# EAGLE design barometer (EAGLE 9.6.2)
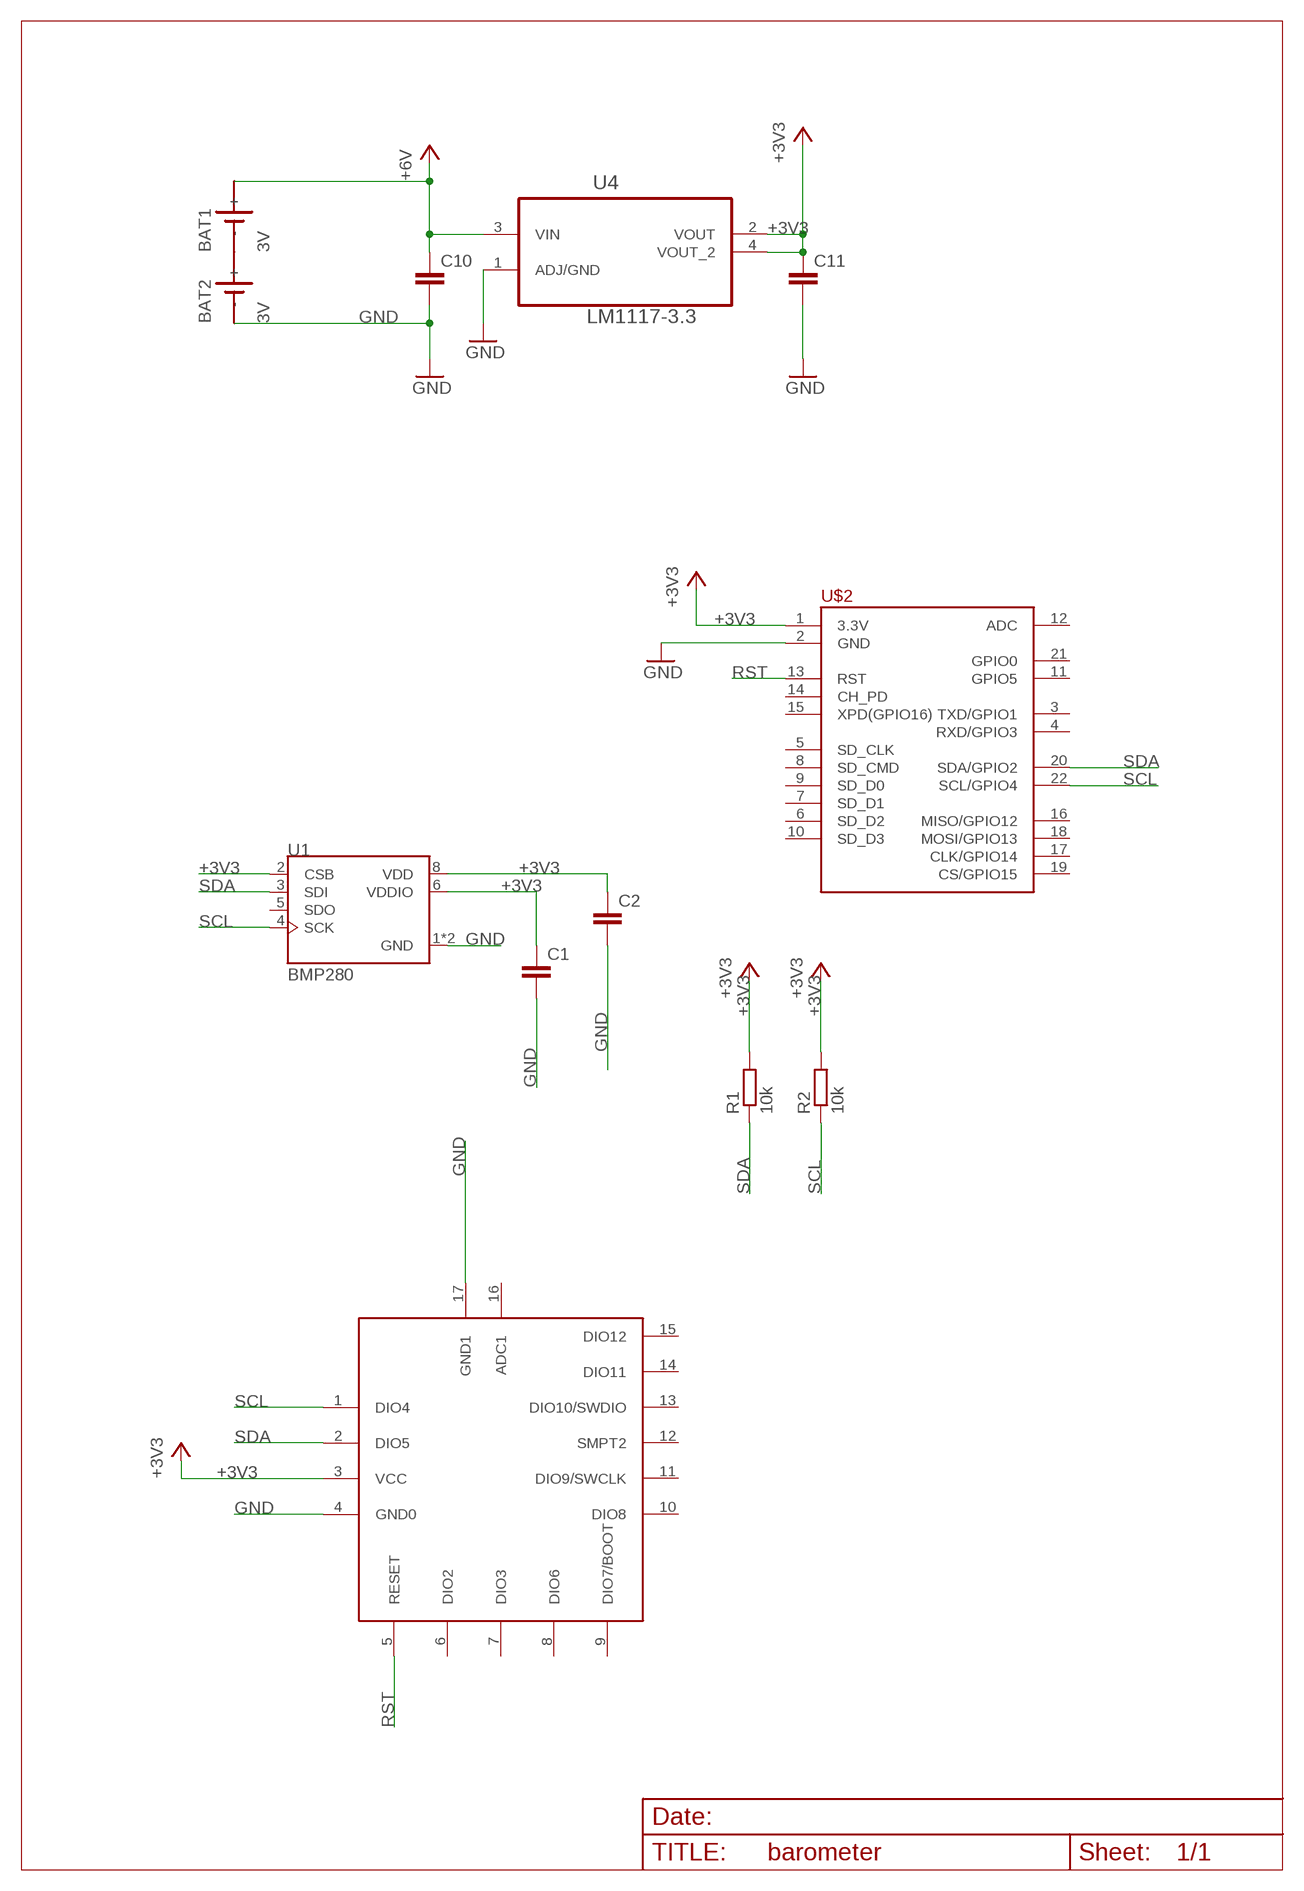
[diagram p0: schematic, sheet 1]

## Parts
BAT1  3V  SN2032  [SN2032]
BAT2  3V  SN2032  [SN2032]
C1  47u  C-EUC1206  [C1206]
C2  47u  C-EUC1206  [C1206]
C10  47u  C-EUC1206  [C1206]
C11  10u  C-EUC1206  [C1206]
R1  10k  R-EU_R0402  [R0402]
R2  10k  R-EU_R0402  [R0402]
U1  BMP280  [XDCR_BMP280]
U4  LM1117-3.3  [SOT230]
U$1  BLUENRG-234BLEMODULE  [BLUENRG-234BLEMODULE]
U$2  OLIMEX_MOD-WIFI-ESP8266-DEV>PINS-OUTSIDE  [OLIMEX_MOD-WIFI-ESP8266-DEV-PINS-OUTSIDE]

## Nets
+3V3 [supply]: C1.1 C2.1 C11.1 R1.2 R2.2 U1.2(CSB) U1.6(VDDIO) U1.8(VDD) U4.2(VOUT) U4.4(VOUT_2) U$1.3(VCC) U$2.1(3.3V)
+6V [supply]: BAT1.+ C10.1 U4.3(VIN)
GND: BAT2.- C1.2 C2.2 C10.2 C11.2 U1.1(GND) U1.7(GND) U4.1(ADJ/GND) U$1.4(GND0) U$1.17(GND1) U$2.2(GND)
N$1: BAT1.- BAT2.+
RST: U$1.5(RESET) U$2.13(RST)
SCL: R2.1 U1.4(SCK) U$1.1(DIO4) U$2.22(SCL/GPIO4)
SDA: R1.1 U1.3(SDI) U$1.2(DIO5) U$2.20(SDA/GPIO2)
Unconnected: U1.5(SDO) U$1.6(DIO2) U$1.7(DIO3) U$1.8(DIO6) U$1.9(DIO7/BOOT) U$1.10(DIO8) U$1.11(DIO9/SWCLK) U$1.12(SMPT2) U$1.13(DIO10/SWDIO) U$1.14(DIO11) U$1.15(DIO12) U$1.16(ADC1) U$2.3(TXD/GPIO1) U$2.4(RXD/GPIO3) U$2.5(SD_CLK) U$2.6(SD_D2) U$2.7(SD_D1) U$2.8(SD_CMD) U$2.9(SD_D0) U$2.10(SD_D3) U$2.11(GPIO5) U$2.12(ADC) U$2.14(CH_PD) U$2.15(XPD(GPIO16)) U$2.16(MISO/GPIO12) U$2.17(CLK/GPIO14) U$2.18(MOSI/GPIO13) U$2.19(CS/GPIO15) U$2.21(GPIO0)

## Library data of the parts
BAT1 BAT2 = sn2032:SN2032: LI BATTERY
C1 C2 C10 C11 = rcl:C-EU: CAPACITOR, European symbol; SPICEPREFIX: C
R1 R2 = rcl:R-EU_: RESISTOR, European symbol; SPICEPREFIX: R
U1 = BMP280:BMP280: BMP280 Absolute Barometric Pressure Sensor for Battery Powered Devices 2 x 2.5mm Check availability <https://pricing.snapeda.com/parts/BMP280/Bosch/view-part?ref=eda>; AVAILABILITY: In Stock; DESCRIPTION: Pressure Sensor 4.35PSI ~ 15.95PSI (30kPa ~ 110kPa) Absolute - 16b 8-SMD; MF: Bosch; MP: BMP280; PACKAGE: LGA-8 Bosch Tools; PRICE: None; PURCHASE-URL: https://pricing.snapeda.com/search/part/BMP280/?ref=eda
U4 = LM1117-3.3:LM1117-3.3: IC REG LDO 800MA 3.3V Check prices <https://pricing.snapeda.com/parts/LM1117-3.3/Texas%20Instruments/view-part?ref=eda>; AVAILABILITY: In Stock; DESCRIPTION: Linear Voltage Regulator IC Positive Fixed 1 Output 800mA DDPAK/TO-263-3; MF: Texas Instruments; MP: LM1117-3.3; PACKAGE: None; PRICE: None
U$1 = BLUENRG-234blemodule:BLUENRG-234BLEMODULE: BLUENRG-234 BLE Module
U$2 = esp8266modules:OLIMEX_MOD-WIFI-ESP8266-DEV: Olimex MOD-WIFI-ESP8266-DEV is an development board for ESP8266 with all GPIOs and resources exposed. It can be soldered to PCB or used with breadboard. Small U.FL connector is provided for external antenna connection.

## Net classes
0 default: width 0.254 mm, clearance 0.203 mm
1 supply: width 0.406 mm, clearance 0.203 mm

## Board
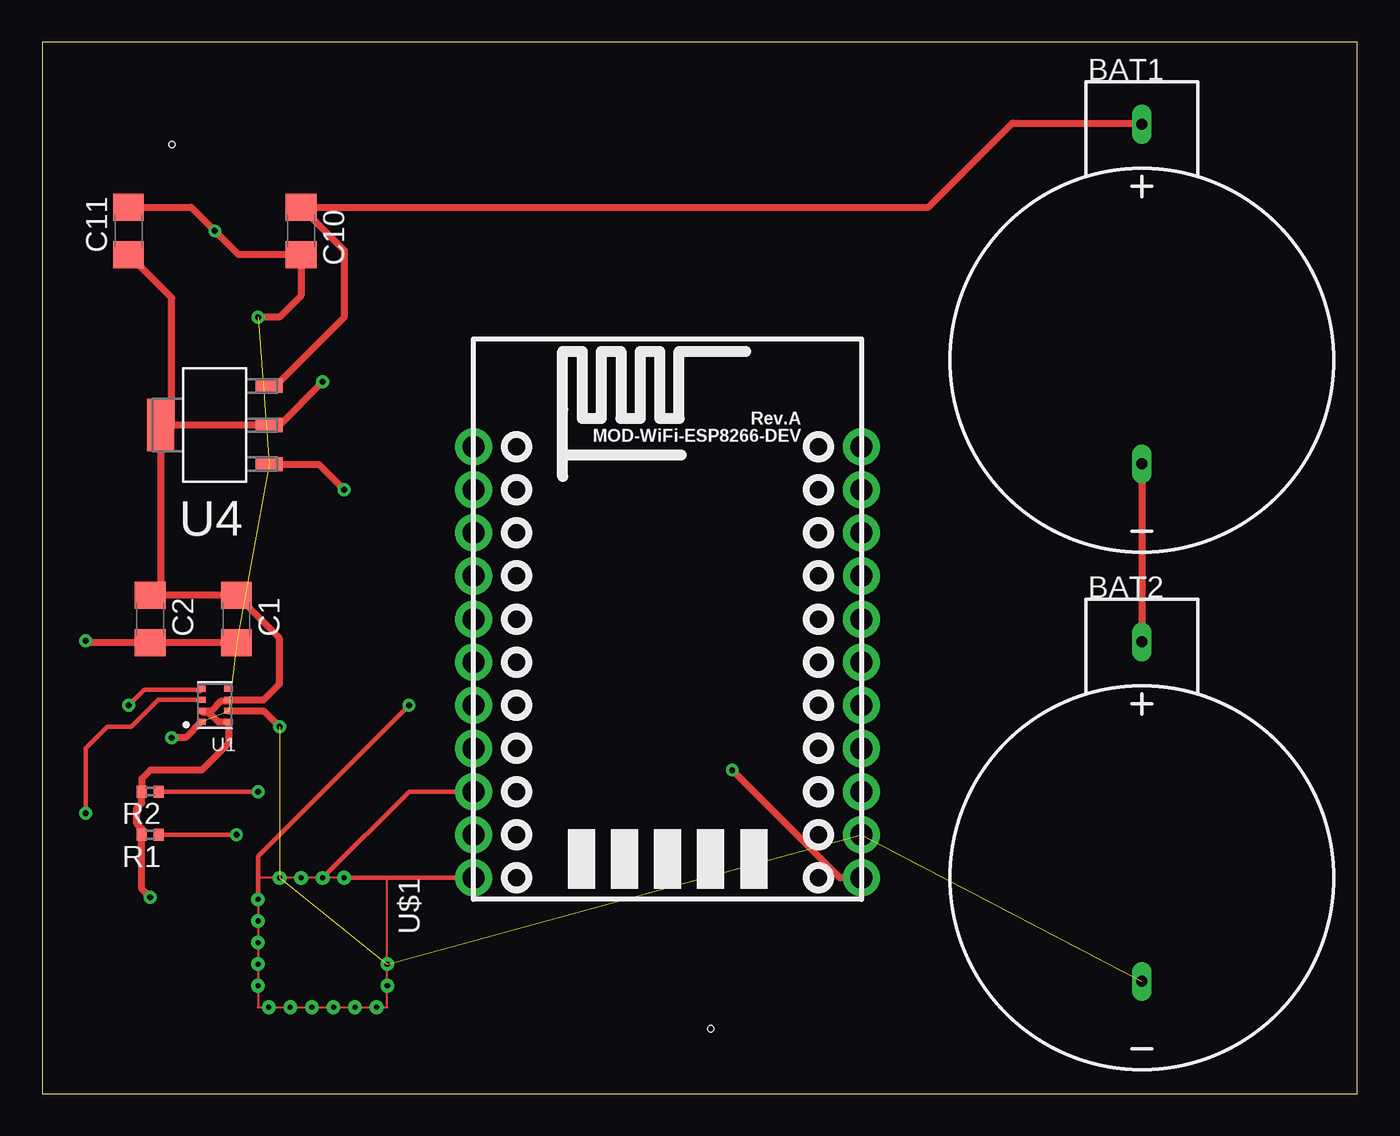
[diagram p1: board, top side]
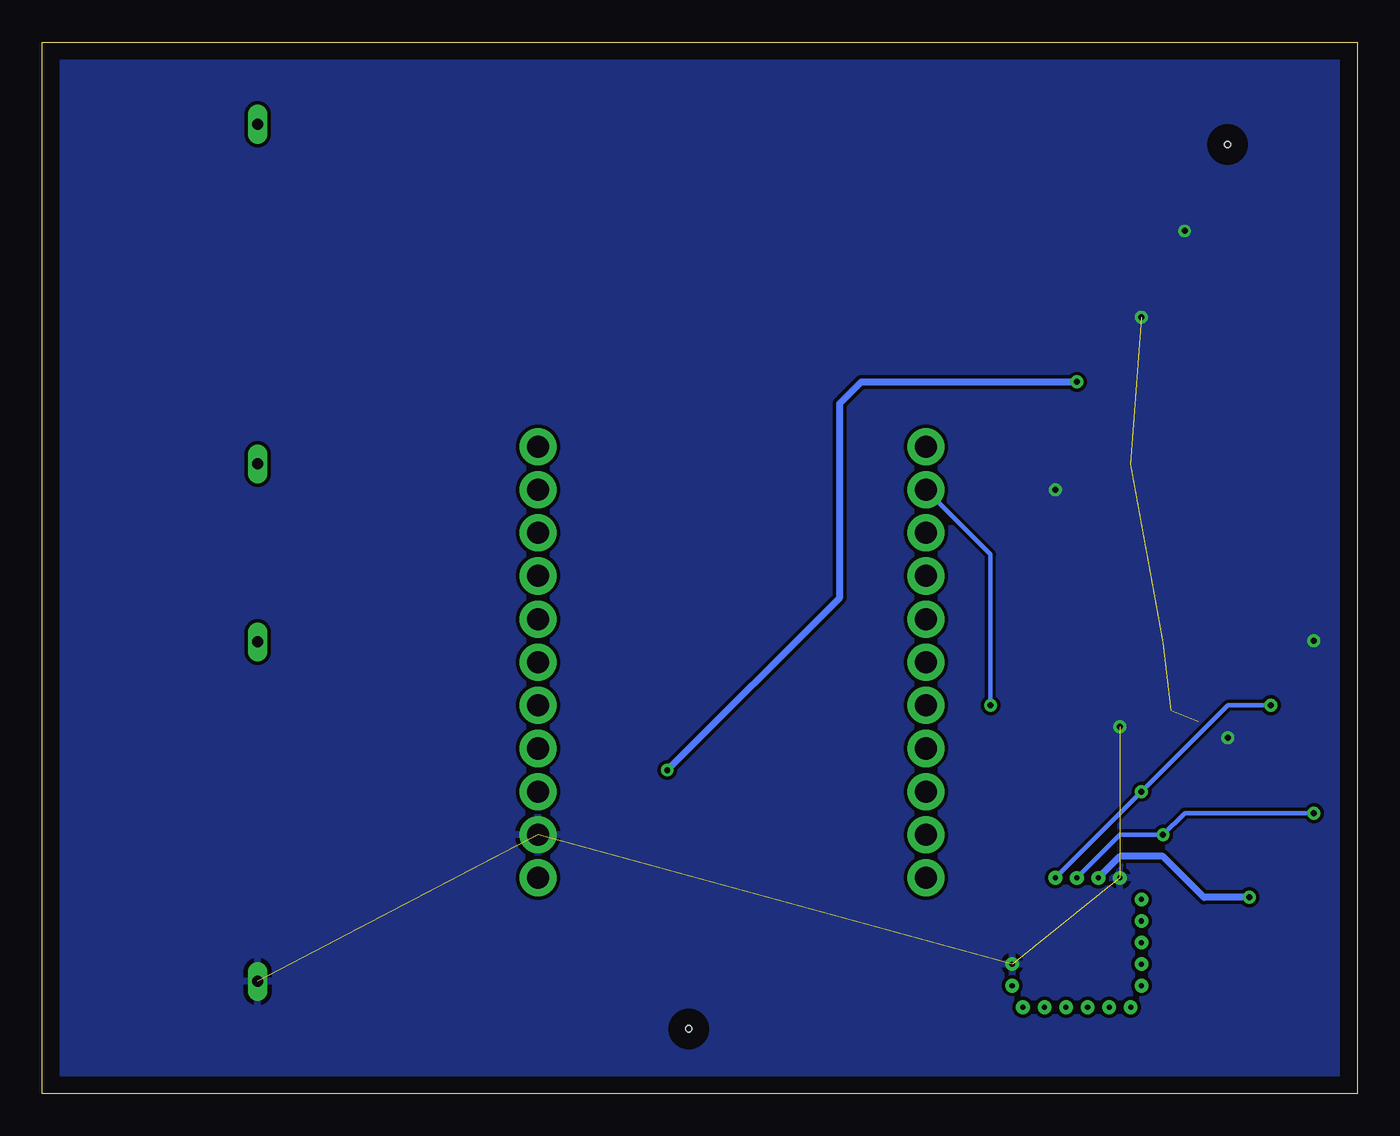
[diagram p2: board, bottom side, seen from below]

Size 77.45 x 61.9 mm. Coordinates in mm from the lower left corner, seen from the top.
Outline: 0,0 77.45,0 77.45,61.9 0,61.9 0,0
Copper layers (1*16): Top 0.035mm / dielectric 1.5mm / Bottom 0.035mm
Design rules "default": minimum track width 6mil, minimum drill 0.35mm, track to track 6mil, track to pad 6mil, pad to pad 6mil, via to via 6mil, smd to smd 6mil, copper to edge 40mil, drill to drill 6mil, minimum pad ring 10mil, minimum via ring 8mil, stop-mask expansion 4mil, vias tented up to drill 0mil, thermal gap 10mil
Holes 0.35 mm at 39.37,3.81 7.62,55.88

### Footprints (pad centres in the part's own frame; a part is rotated, then mirrored left to right if it is on the bottom)
SN2032 = drill 0.65 long: + 0,13.9; - 0,-6.1
C1206 = smd 1.6 x 1.8: 1 -1.4,0; 2 1.4,0
R0402 = smd 0.6 x 0.7: 1 -0.5,0; 2 0.5,0
XDCR_BMP280 = smd 0.5 x 0.35: 1 0.8,0.975; 2 0.8,0.325; 3 0.8,-0.325; 4 0.8,-0.975; 5 -0.8,-0.975; 6 -0.8,-0.325; 7 -0.8,0.325; 8 -0.8,0.975
SOT230 = smd 1.6 x 0.838: 1 -3.2,2.311; 2 -3.2,0; 3 -3.2,-2.311 | smd 1.6 x 3.099: 4 3.2,0
BLUENRG-234BLEMODULE = drill 0.3 pad 0.813: 1 -3.81,1.27 | drill 0.3: 2 -3.81,0; 3 -3.81,-1.27; 4 -3.81,-2.54; 5 -2.54,-3.81; 6 -1.27,-3.81; 7 0,-3.81; 8 1.27,-3.81; 9 2.54,-3.81; 10 3.81,-3.175; 11 3.81,-1.905; 12 3.81,-0.635; 13 3.81,0.635; 14 3.81,1.905; 15 3.81,3.175; 16 2.54,3.81; 17 1.27,3.81
OLIMEX_MOD-WIFI-ESP8266-DEV-PINS-OUTSIDE = drill 1.3 pad 2.184: 1 0,0; 2 0,-2.54; 3 0,-5.08; 4 0,-7.62; 5 0,-10.16; 6 0,-12.7; 7 0,-15.24; 8 0,-17.78; 9 0,-20.32; 10 0,-22.86; 11 0,-25.4; 12 22.86,-25.4; 13 22.86,-22.86; 14 22.86,-20.32; 15 22.86,-17.78; 16 22.86,-15.24; 17 22.86,-12.7; 18 22.86,-10.16; 19 22.86,-7.62; 20 22.86,-5.08; 21 22.86,-2.54; 22 22.86,0

### Placement (x,y rotation side)
BAT1  64.77,43.18 0 top
BAT2  64.77,12.7 0 top
C1  11.43,27.94 270 top
C2  6.35,27.94 270 top
C10  15.24,50.8 270 top
C11  5.08,50.8 90 top
R1  6.35,15.24 180 top
R2  6.35,17.78 180 top
U1  10.16,22.86 180 top
U4  10.16,39.37 180 top
U$1  16.51,8.89 270 top
U$2  48.26,12.7 180 top

### Tracks (layer width: path | path; a pad name or v marks a point on that pad's centre or on a via)
+3V3  (via drill 0.35)
  Top 0.406: 7.62,39.37 7.62,46.86 C11.1 | 7.62,39.37 U4.2 13.97,39.37 v16.51,41.91 | U$2.1 46.99,12.7 v40.64,19.05 | v6.35,11.55 5.85,12.05 R1.2 5.85,15.6 5.57,15.89 5.57,16.84 5.85,17.12 R2.2 5.85,18.55 6.35,19.05 9.39,19.05 10.96,20.61 U1.8 10.36,21.89 9.78,22.47 9.43,22.47 U1.2 9.96,22.54 10.54,23.12 10.89,23.12 U1.6 13.03,23.18 13.97,24.13 13.97,26.8 C1.1 C2.1 6.96,29.95 U4.4 7.62,39.37
  Bottom 0.406: v40.64,19.05 30.48,29.21 30.48,40.64 29.21,41.91 v16.51,41.91 | v6.35,11.55 9.01,11.55 11.43,13.97 13.97,13.97 U$1.3
+6V
  Top 0.406: BAT1.+ 64.7,57.15 57.15,57.15 52.2,52.2 C10.1 17.78,49.66 17.78,45.72 13.74,41.68 U4.3
GND  (via drill 0.35)  (8 unrouted)
  Top 0.406: C11.2 8.76,52.2 v10.16,50.8 11.56,49.4 C10.2 15.24,46.99 13.97,45.72 v12.7,45.72 | U1.1 8.43,20.95 v7.62,20.95 | U1.7 13.03,22.54 v13.97,21.59 | C1.2 C2.2 2.67,26.54 v2.54,26.67 | U4.1 16.28,37.06 v17.78,35.56
  pour Bottom: -7.62,64.77 -7.62,-6.35 78.74,-6.35 80.01,-5.08 85.09,0 85.09,66.04
N$1
  Top 0.406: BAT1.- BAT2.+
RST  (via drill 0.35)
  Top 0.254: U$1.5 12.7,13.97 v21.59,22.86
  Bottom 0.254: v21.59,22.86 21.59,31.75 U$2.13
SCL  (via drill 0.35)
  Top 0.254: v12.7,17.78 R2.1 | U$1.1 U$2.22 | 9.29,23.77 5.99,23.77 v5.08,22.86
  Top 0.406: U1.4 9.29,23.77
  Bottom 0.254: U$1.1 v12.7,17.78 7.62,22.86 v5.08,22.86
SDA  (via drill 0.35)
  Top 0.254: U$1.2 21.59,17.78 U$2.20 | R1.1 v11.43,15.24 | U1.3 6.82,23.18 5.22,21.59 3.81,21.59 2.54,20.32 v2.54,16.51
  Bottom 0.254: U$1.2 13.97,15.24 v11.43,15.24 10.16,16.51 v2.54,16.51